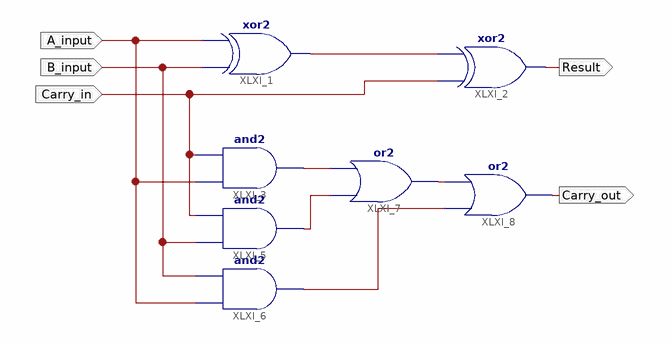
[diagram p0: schematic sheet 1]
// Xilinx ISE schematic lab5_5_FA.sch (spartan3) as structural Verilog: 7 symbols, 5 ports
module lab5_5_FA (
  input  Carry_in,
  input  B_input,
  input  A_input,
  output Result,
  output Carry_out
);

  wire XLXN_1, XLXN_9, XLXN_10, XLXN_11, XLXN_12;

  xor XLXI_1 (XLXN_1, B_input, A_input);
  xor XLXI_2 (Result, Carry_in, XLXN_1);
  or XLXI_8 (Carry_out, XLXN_12, XLXN_11);
  or XLXI_7 (XLXN_11, XLXN_10, XLXN_9);
  and XLXI_6 (XLXN_12, A_input, B_input);
  and XLXI_5 (XLXN_10, B_input, Carry_in);
  and XLXI_3 (XLXN_9, A_input, Carry_in);
endmodule
